# Altium schematic sheet OSD.SchDoc
size A4
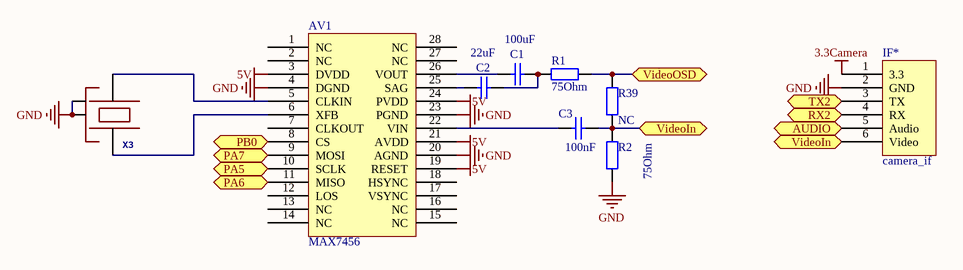
[diagram p0: OSD.SchDoc]

## Parts
AV1  MAX7456  [28TSSOP]
C1  value 100uF  [1210]
C2  value 22uF  [1210]
C3  value 100nF  [0603]
IF*  camera_if  [WFRSM125]
R1  value 75Ohm  [0603]
R2  value 75Ohm  [0603]
R39  value NC  [0603]
X3  8mhz  [OSCILLATOR-3.2X2.5]  (value not drawn)

## Ports
AUDIO, PA5, PA6, PA7, PB0, RX2, TX2, VideoIn, VideoOSD

## Nets
3.3Camera: IF*.1(3.3)
5V: AV1.3(DVDD) AV1.19(RESET) AV1.21(AVDD) AV1.24(PVDD)
GND: AV1.4(DGND) AV1.20(AGND) AV1.23(PGND) IF*.2(GND) R2.1 X3.2(NC_2) X3.4(NC_4)
AUDIO: IF*.5(Audio) ; port AUDIO
PA5: AV1.10(SCLK) ; port PA5
PA6: AV1.11(MISO) ; port PA6
PA7: AV1.9(MOSI) ; port PA7
PB0: AV1.8(CS) ; port PB0
RX2: IF*.4(RX) ; port RX2
TX2: IF*.3(TX) ; port TX2
VideoIn: C3.2 IF*.6(Video) R2.2 R39.1 ; port VideoIn
VideoOSD: R1.2 R39.2 ; port VideoOSD
NetAV1_5: AV1.5(CLKIN) X3.1
NetAV1_6: AV1.6(XFB) X3.3
NetAV1_22: AV1.22(VIN) C3.1
NetAV1_25: AV1.25(SAG) C2.1
NetAV1_26: AV1.26(VOUT) C1.1
NetC1_2: C1.2 C2.2 R1.1

Not connected (* = marked no-connect by the designer): AV1 1(NC) 2(NC) 7(CLKOUT) 12(LOS) 13(NC) 14(NC) 15(NC) 16(NC) 17(VSYNC) 18(HSYNC) 27(NC) 28(NC)

## Library data of the parts
C1-C3 = Cap Semi: Capacitor (Semiconductor SIM Model); Published: 8-Jun-2000; LatestRevisionDate: 29-May-2009; LatestRevisionNote: IPC-7351 Footprint Added.; PackageReference: C1206; Publisher: Altium Limited; PackageDescription: Chip Capacitor
R1 R2 R39 = Res2: Resistor; Published: 8-Jun-2000; LatestRevisionDate: 17-Jul-2002; LatestRevisionNote: Re-released for DXP Platform.; PackageReference: AXIAL-0.4; Publisher: Altium Limited; PackageDescription: Axial Device, Thru-Hole; 2 Leads; 0.4 in Pin Spacing
X3 = OSCILLATOR-3.2X2.5: Crystal Oscillator in 3.2x2.5 SMD